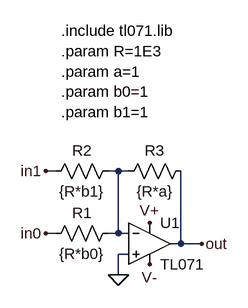
[diagram p0: schematic summer.asc]
summer.asc, the LTspice schematic file:
Version 4
SHEET 1 880 680
WIRE 80 -496 64 -496
WIRE 176 -496 160 -496
WIRE 192 -496 176 -496
WIRE 80 -400 64 -400
WIRE 176 -400 176 -496
WIRE 176 -400 160 -400
WIRE 192 -400 176 -400
WIRE 272 -384 272 -496
WIRE 272 -384 256 -384
WIRE 304 -384 272 -384
WIRE 192 -368 176 -368
WIRE 176 -336 176 -368
FLAG 64 -400 in0
FLAG 304 -384 out
FLAG 64 -496 in1
FLAG 176 -336 0
FLAG 224 -416 V+
FLAG 224 -352 V-
SYMBOL res 288 -512 R90
WINDOW 0 0 56 VBottom 2
WINDOW 3 32 56 VTop 2
SYMATTR InstName R3
SYMATTR Value {R*a}
SYMBOL res 176 -416 R90
WINDOW 0 0 56 VBottom 2
WINDOW 3 32 56 VTop 2
SYMATTR InstName R1
SYMATTR Value {R*b0}
SYMBOL res 176 -512 R90
WINDOW 0 0 56 VBottom 2
WINDOW 3 32 56 VTop 2
SYMATTR InstName R2
SYMATTR Value {R*b1}
SYMBOL opamp2 224 -448 R0
SYMATTR InstName U1
SYMATTR Value TL071
TEXT 88 -712 Left 2 !.include tl071.lib\n.param R=1E3\n.param a=1\n.param b0=1\n.param b1=1

The netlist it stands for:
* summer.asc
R3 out N001 {R*a}
R1 N001 in0 {R*b0}
R2 N001 in1 {R*b1}
XU1 0 N001 V+ V- out TL071  ; pins In+ In- V+ V- OUT
.include tl071.lib
.param R=1E3
.param a=1
.param b0=1
.param b1=1
.backanno
.end